# EAGLE design RFH-2 (EAGLE 9.3.0)
REVISION: C
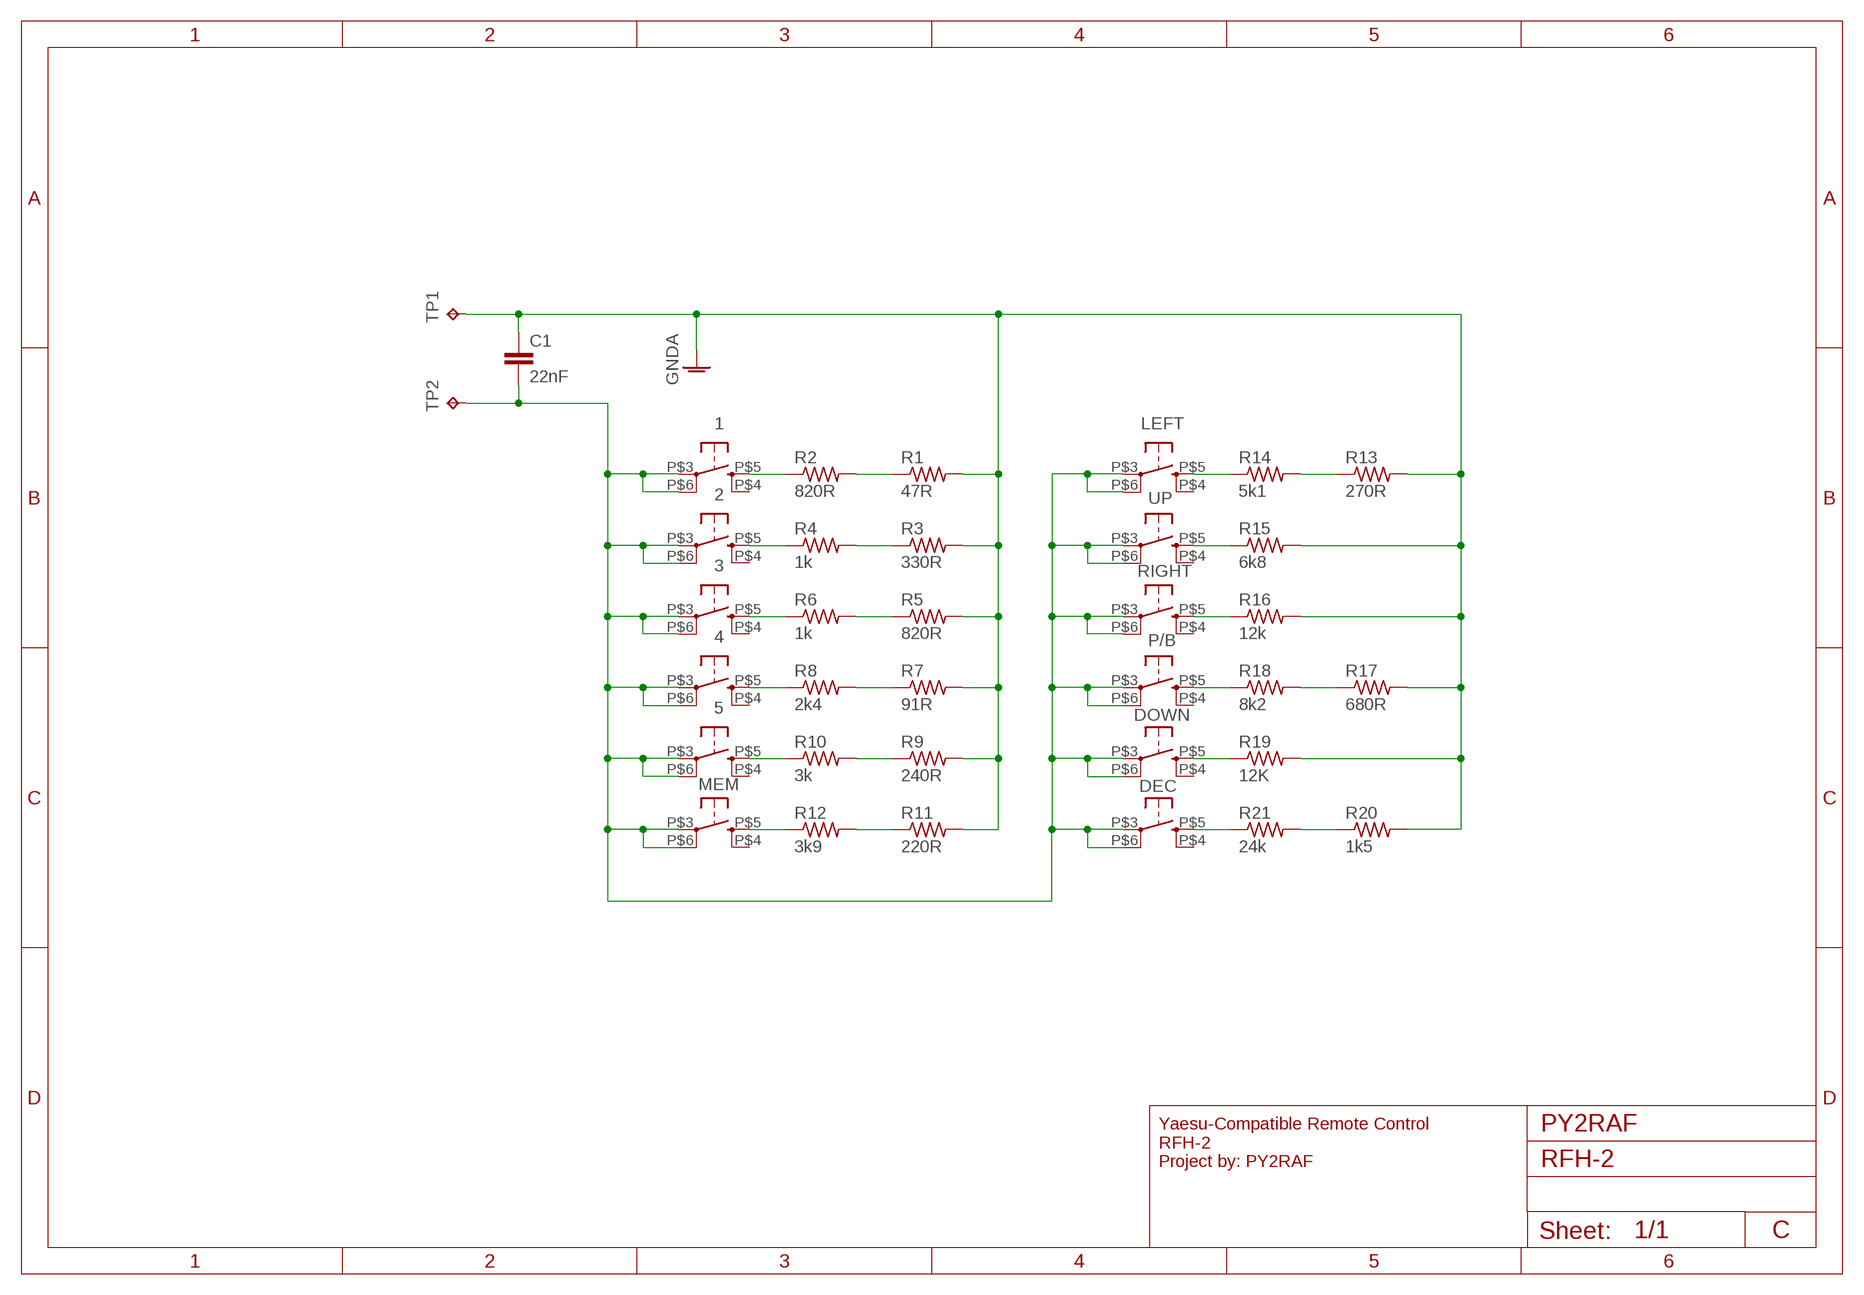
[diagram p0: schematic, sheet 1]

## Parts
1  TL6300-SPST  [TL6300]
2  TL6300-SPST  [TL6300]
3  TL6300-SPST  [TL6300]
4  TL6300-SPST  [TL6300]
5  TL6300-SPST  [TL6300]
C1  22nF  C5/3  [C5B3]
DEC  TL6300-SPST  [TL6300]
DOWN  TL6300-SPST  [TL6300]
LEFT  TL6300-SPST  [TL6300]
MEM  TL6300-SPST  [TL6300]
P/B  TL6300-SPST  [TL6300]
R1  47R  R-US_0309/10  [0309/10]
R2  820R  R-US_0309/10  [0309/10]
R3  330R  R-US_0309/10  [0309/10]
R4  1k  R-US_0309/10  [0309/10]
R5  820R  R-US_0309/10  [0309/10]
R6  1k  R-US_0309/10  [0309/10]
R7  91R  R-US_0309/10  [0309/10]
R8  2k4  R-US_0309/10  [0309/10]
R9  240R  R-US_0309/10  [0309/10]
R10  3k  R-US_0309/10  [0309/10]
R11  220R  R-US_0309/10  [0309/10]
R12  3k9  R-US_0309/10  [0309/10]
R13  270R  R-US_0309/10  [0309/10]
R14  5k1  R-US_0309/10  [0309/10]
R15  6k8  R-US_0309/10  [0309/10]
R16  12k  R-US_0309/10  [0309/10]
R17  680R  R-US_0309/10  [0309/10]
R18  8k2  R-US_0309/10  [0309/10]
R19  12K  R-US_0309/10  [0309/10]
R20  1k5  R-US_0309/10  [0309/10]
R21  24k  R-US_0309/10  [0309/10]
RIGHT  TL6300-SPST  [TL6300]
TP1  TPPAD1-20Y  [P1-20Y]
TP2  TPPAD1-20Y  [P1-20Y]
UP  TL6300-SPST  [TL6300]

## Nets
GNDA: C1.1 R1.2 R3.2 R5.2 R7.2 R9.2 R11.2 R13.2 R15.2 R16.2 R17.2 R19.2 R20.2 TP1.TP
N$1: 1.P$3(P) 1.P$6(P1) 2.P$3(P) 2.P$6(P1) 3.P$3(P) 3.P$6(P1) 4.P$3(P) 4.P$6(P1) 5.P$3(P) 5.P$6(P1) C1.2 DEC.P$3(P) DEC.P$6(P1) DOWN.P$3(P) DOWN.P$6(P1) LEFT.P$3(P) LEFT.P$6(P1) MEM.P$3(P) MEM.P$6(P1) P/B.P$3(P) P/B.P$6(P1) RIGHT.P$3(P) RIGHT.P$6(P1) TP2.TP UP.P$3(P) UP.P$6(P1)
N$2: R17.1 R18.2
N$3: LEFT.P$5(S) R14.1
N$4: R15.1 UP.P$5(S)
N$5: R16.1 RIGHT.P$5(S)
N$6: P/B.P$5(S) R18.1
N$7: DOWN.P$5(S) R19.1
N$8: 1.P$5(S) R2.1
N$9: DEC.P$5(S) R21.1
N$10: 2.P$5(S) R4.1
N$11: 3.P$5(S) R6.1
N$12: 4.P$5(S) R8.1
N$13: 5.P$5(S) R10.1
N$14: MEM.P$5(S) R12.1
N$15: R13.1 R14.2
N$20: R1.1 R2.2
N$21: R3.1 R4.2
N$22: R5.1 R6.2
N$23: R7.1 R8.2
N$24: R9.1 R10.2
N$25: R11.1 R12.2
N$26: R20.1 R21.2
Unconnected: 1.P$4(S1) 2.P$4(S1) 3.P$4(S1) 4.P$4(S1) 5.P$4(S1) DEC.P$4(S1) DOWN.P$4(S1) LEFT.P$4(S1) MEM.P$4(S1) P/B.P$4(S1) RIGHT.P$4(S1) UP.P$4(S1)

## Notes on the sheet
- PY2RAF
- Yaesu-Compatible Remote Control
  RFH-2
  Project by: PY2RAF

## Library data of the parts
1-5 DEC DOWN LEFT MEM P/B RIGHT UP = aarf:TL6300-SPST
C1 = capacitor-wima:C: CAPACITOR naming: grid - package width
R1-R21 = rcl:R-US_: RESISTOR, American symbol; SPICEPREFIX: R
TP1 TP2 = testpad:TP: Test pad

## Board
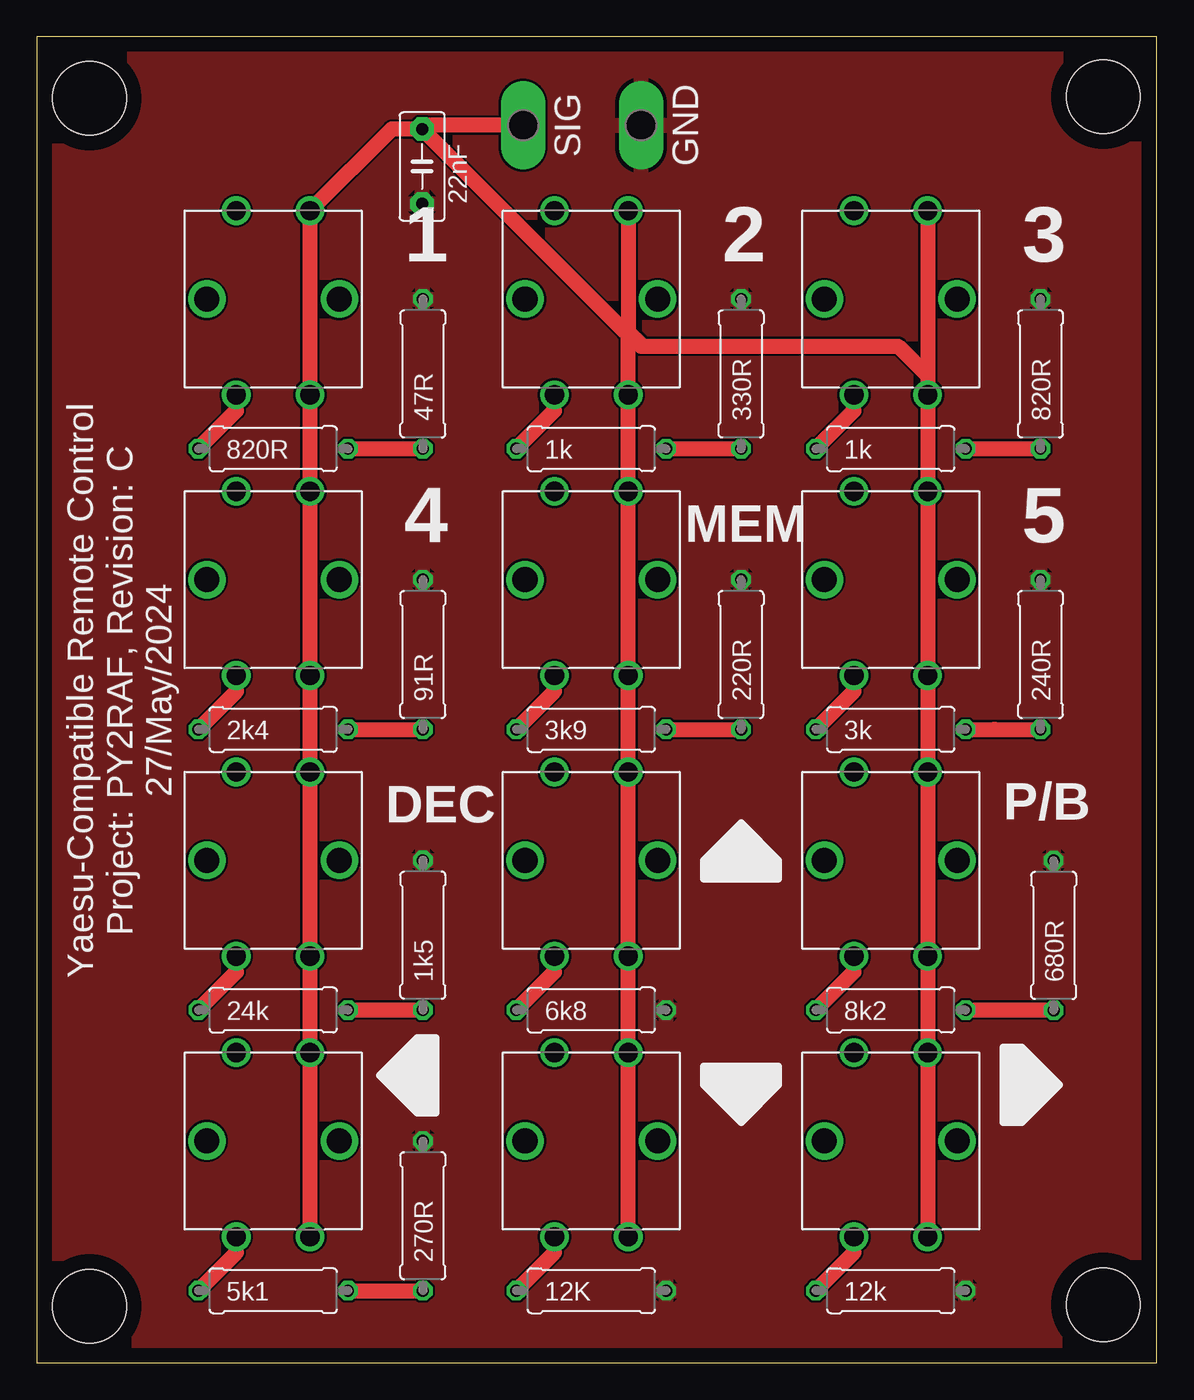
[diagram p1: board, top side]
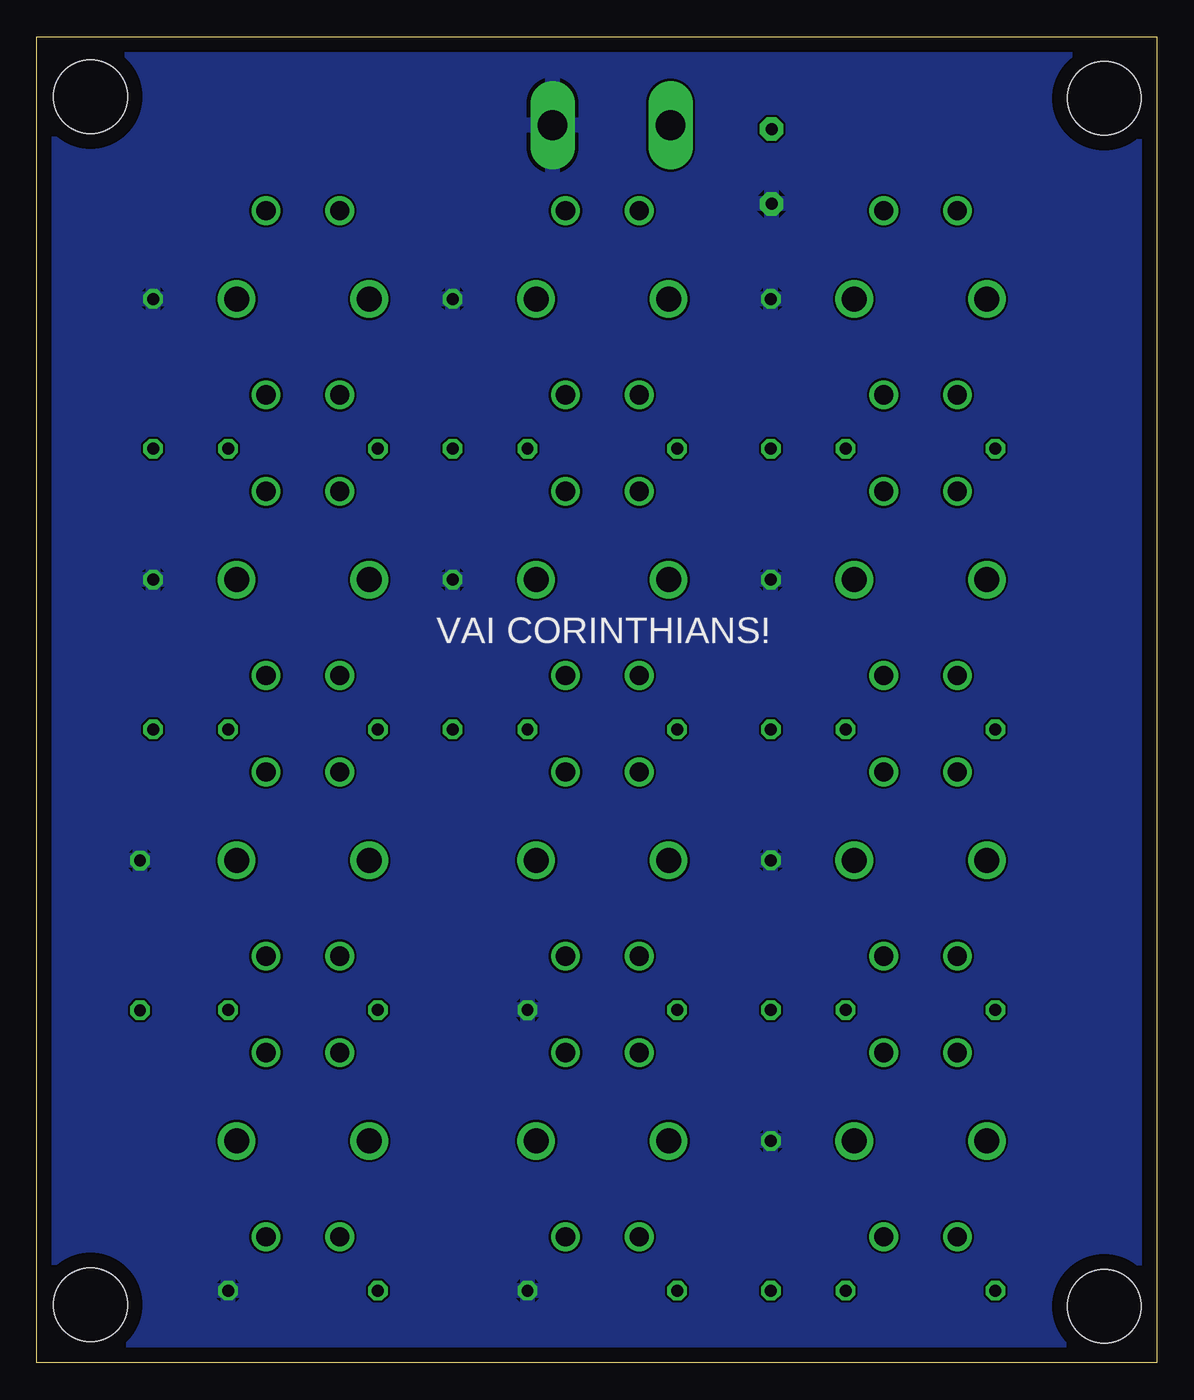
[diagram p2: board, bottom side, seen from below]

Size 76 x 90 mm. Coordinates in mm from the lower left corner, seen from the top.
Outline: 0,0 76,0 76,90 0,90 0,0
Copper layers (1*16): Top 0.035mm / dielectric 1.5mm / Bottom 0.035mm
Design rules "default": minimum track width 6mil, minimum drill 0.35mm, track to track 6mil, track to pad 6mil, pad to pad 6mil, via to via 6mil, smd to smd 6mil, copper to edge 40mil, drill to drill 6mil, minimum pad ring 10mil, minimum via ring 8mil, stop-mask expansion 4mil, vias tented up to drill 0mil, thermal gap 10mil
Holes 5 mm at 3.57,3.83 72.36,3.94 3.57,85.83 72.36,85.94

### Footprints (pad centres in the part's own frame; a part is rotated, then mirrored left to right if it is on the bottom)
TL6300 = drill 1.7: P$1 -4.5,0; P$2 4.5,0 | drill 1.3: P$3 2.5,6; P$4 -2.5,6; P$5 -2.5,-6.5; P$6 2.5,-6.5
C5B3 = drill 0.813 pad 1.6 octagon: 1 -2.54,0; 2 2.54,0
0309/10 = drill 0.813 octagon: 1 -5.08,0; 2 5.08,0
P1-20Y = drill 2.007 pad 2.54 long: TP 0,0

### Placement (x,y rotation side)
1  16.04,72.2 0 top
2  37.62,72.2 0 top
3  57.95,72.2 0 top
4  16.04,53.15 0 top
5  57.95,53.15 0 top
C1  26.14,81.2 90 top
DEC  16.04,34.1 0 top
DOWN  37.62,15.05 0 top
LEFT  16.04,15.05 0 top
MEM  37.62,53.15 0 top
P/B  57.95,34.1 0 top
R1  26.2,67.12 90 top
R2  16.04,62.04 0 top
R3  47.78,67.12 90 top
R4  37.62,62.04 0 top
R5  68.11,67.12 90 top
R6  57.95,62.04 0 top
R7  26.2,48.07 90 top
R8  16.04,42.99 0 top
R9  68.11,48.07 90 top
R10  57.95,42.99 0 top
R11  47.78,48.07 90 top
R12  37.62,42.99 0 top
R13  26.2,9.97 90 top
R14  16.04,4.89 0 top
R15  37.62,23.94 0 top
R16  57.95,4.89 0 top
R17  69,29 90 top
R18  57.95,23.94 0 top
R19  37.62,4.89 0 top
R20  26.2,29.02 90 top
R21  16.04,23.94 0 top
RIGHT  57.95,15.05 0 top
TP1  41,84 0 top
TP2  33,84 0 top
UP  37.62,34.1 0 top

### Tracks (layer width: path | path; a pad name or v marks a point on that pad's centre or on a via)
GNDA
  pour Bottom (isolate 0.305): 0,0 0,90 76,90 76,0
  pour Bottom: 0,90 0,0 76,0 76,90
  pour Top: 0,90 0,0 76,0 76,90
N$1
  Top 1.016: TP2.TP 26.41,84 C1.2 | C1.2 24.07,83.74 1.P$3 1.P$6 4.P$3 4.P$6 DEC.P$3 DEC.P$6 LEFT.P$3 LEFT.P$6 | 2.P$3 40.12,70 | DOWN.P$6 DOWN.P$3 UP.P$6 UP.P$3 MEM.P$6 MEM.P$3 2.P$6 40.12,70 | 3.P$6 5.P$3 5.P$6 P/B.P$3 P/B.P$6 RIGHT.P$3 RIGHT.P$6 | 3.P$6 60.45,67 58.45,69 50,69 41,69 41,69.12 40.12,70 | 3.P$3 3.P$6 | 40.12,70 39.88,70 C1.2
N$2
  Top 1.016: R18.2 68.98,23.94 R17.1
N$3
  Top 1.016: R14.1 13.54,7.47 LEFT.P$5
N$4
  Top 1.016: R15.1 35.12,26.52 UP.P$5
N$5
  Top 1.016: R16.1 55.45,7.47 RIGHT.P$5
N$6
  Top 1.016: R18.1 55.45,26.52 P/B.P$5
N$7
  Top 1.016: R19.1 35.12,7.47 DOWN.P$5
N$8
  Top 1.016: R2.1 13.54,64.62 1.P$5
N$9
  Top 1.016: R21.1 13.54,26.52 DEC.P$5
N$10
  Top 1.016: R4.1 35.12,64.62 2.P$5
N$11
  Top 1.016: R6.1 55.45,64.62 3.P$5
N$12
  Top 1.016: R8.1 13.54,45.57 4.P$5
N$13
  Top 1.016: R10.1 55.45,45.57 5.P$5
N$14
  Top 1.016: R12.1 35.12,45.57 MEM.P$5
N$15
  Top 1.016: R14.2 R13.1
N$20
  Top 1.016: R2.2 R1.1
N$21
  Top 1.016: R4.2 R3.1
N$22
  Top 1.016: R6.2 R5.1
N$23
  Top 1.016: R8.2 R7.1
N$24
  Top 1.016: R10.2 65,42.99 R9.1
N$25
  Top 1.016: R12.2 R11.1
N$26
  Top 1.016: R21.2 R20.1

### Text on the board
tPlace: 1 | 2 | 3 | 4 | MEM | 5 | Yaesu-Compatible Remote Control / Project: PY2RAF, Revision: C / 27/May/2024 | DEC | P/B
bPlace: VAI CORINTHIANS!
tNames: SIG | GND